# EAGLE design ESP_Hub (EAGLE 9.6.0)
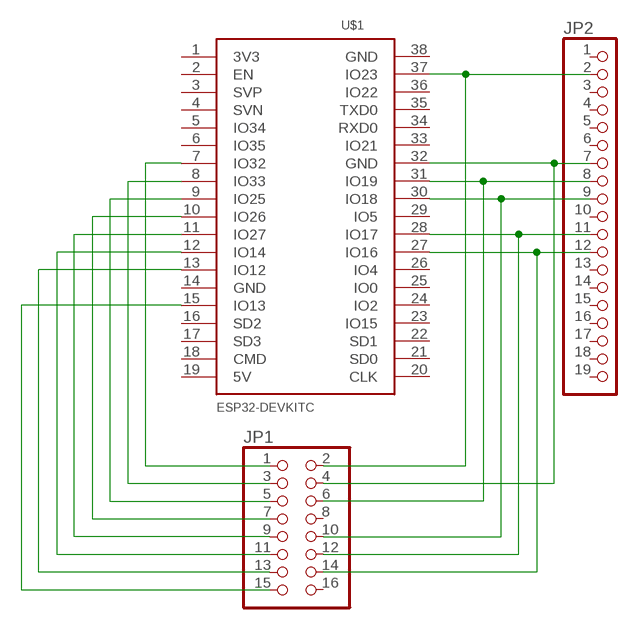
[diagram p0: schematic, sheet 1]

## Parts
JP1  PINHD-2X8  [2X08]
JP2  PINHD-1X19  [1X19]
U$1  ESP32DEVKITC  [ESP32-DEVKITC]

## Nets
N$1: JP1.1 U$1.7(IO32)
N$2: JP1.3 U$1.8(IO33)
N$3: JP1.5 U$1.9(IO25)
N$4: JP1.15 U$1.15(IO13)
N$5: JP1.7 U$1.10(IO26)
N$6: JP1.9 U$1.11(IO27)
N$7: JP1.11 U$1.12(IO14)
N$8: JP1.13 U$1.13(IO12)
N$9: JP1.2 JP2.2 U$1.37(IO23)
N$10: JP1.6 JP2.8 U$1.31(IO19)
N$11: JP1.10 JP2.9 U$1.30(IO18)
N$12: JP1.12 JP2.11 U$1.28(IO17)
N$13: JP1.14 JP2.12 U$1.27(IO16)
N$14: JP1.4 JP2.7 U$1.32(GND)
Unconnected: JP1.8 JP1.16 JP2.1 JP2.3 JP2.4 JP2.5 JP2.6 JP2.10 JP2.13 JP2.14 JP2.15 JP2.16 JP2.17 JP2.18 JP2.19 U$1.1(3V3) U$1.2(EN) U$1.3(SVP) U$1.4(SVN) U$1.5(IO34) U$1.6(IO35) U$1.14(GND) U$1.16(SD2) U$1.17(SD3) U$1.18(CMD) U$1.19(5V) U$1.20(CLK) U$1.21(SD0) U$1.22(SD1) U$1.23(IO15) U$1.24(IO2) U$1.25(IO0) U$1.26(IO4) U$1.29(IO5) U$1.33(IO21) U$1.34(RXD0) U$1.35(TXD0) U$1.36(IO22) U$1.38(GND)

## Library data of the parts
JP1 = pinhead:PINHD-2X8: PIN HEADER
JP2 = pinhead:PINHD-1X19: PIN HEADER
U$1 = ESP32-DEVKITC:ESP32DEVKITC

## Board
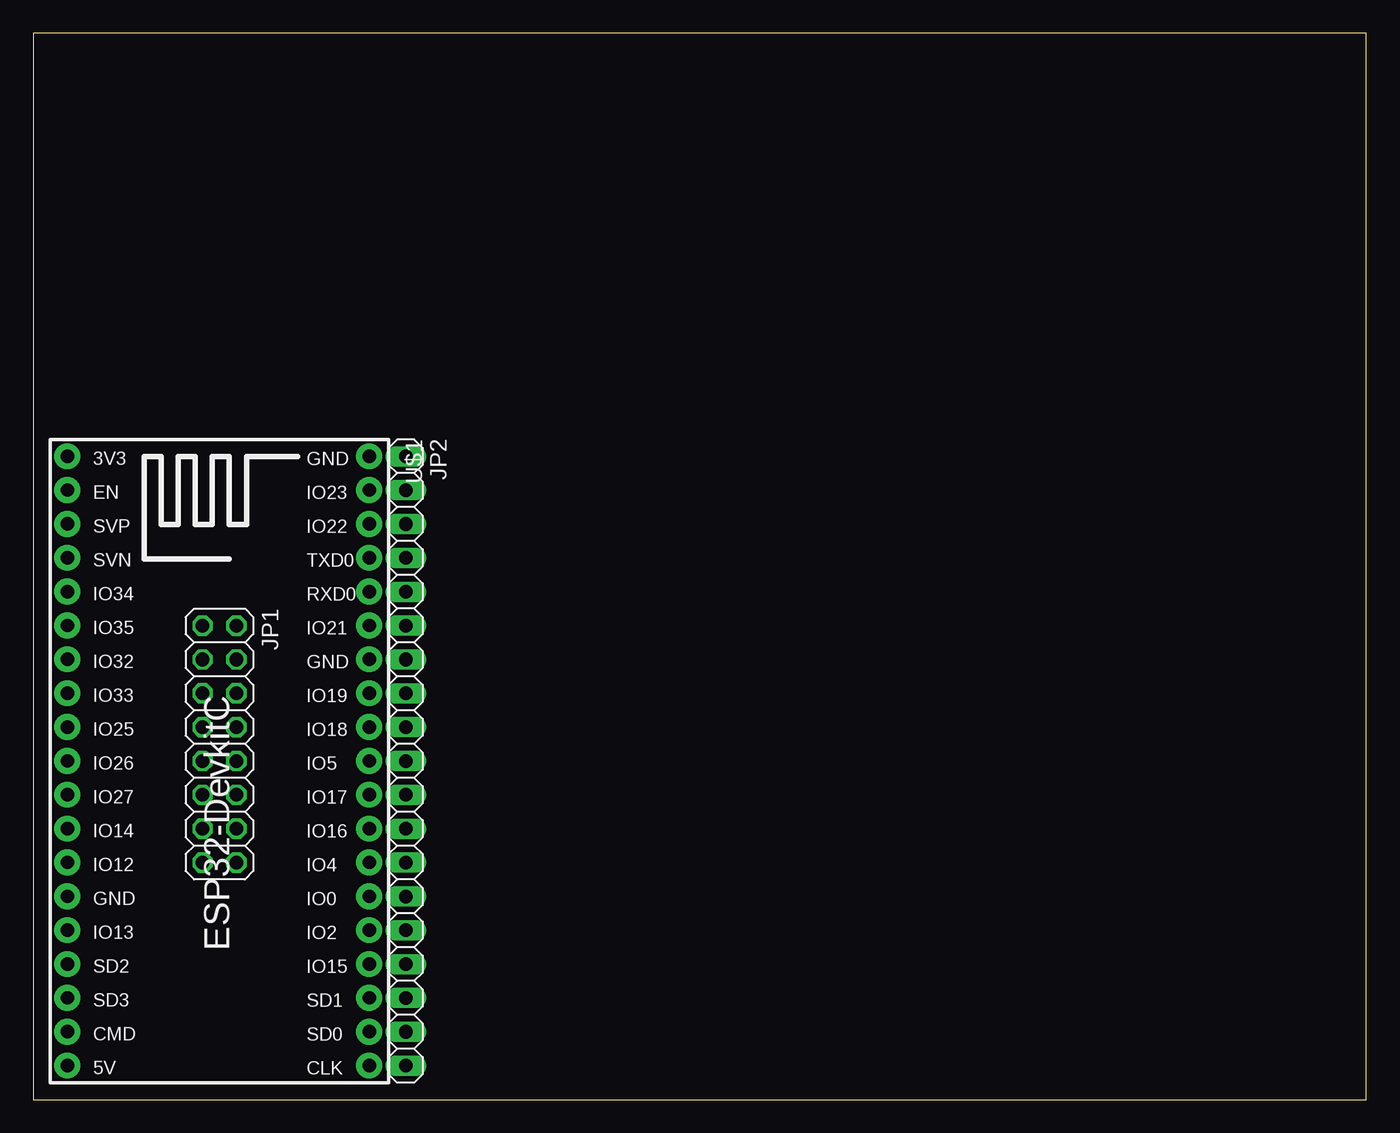
[diagram p1: board, top side]
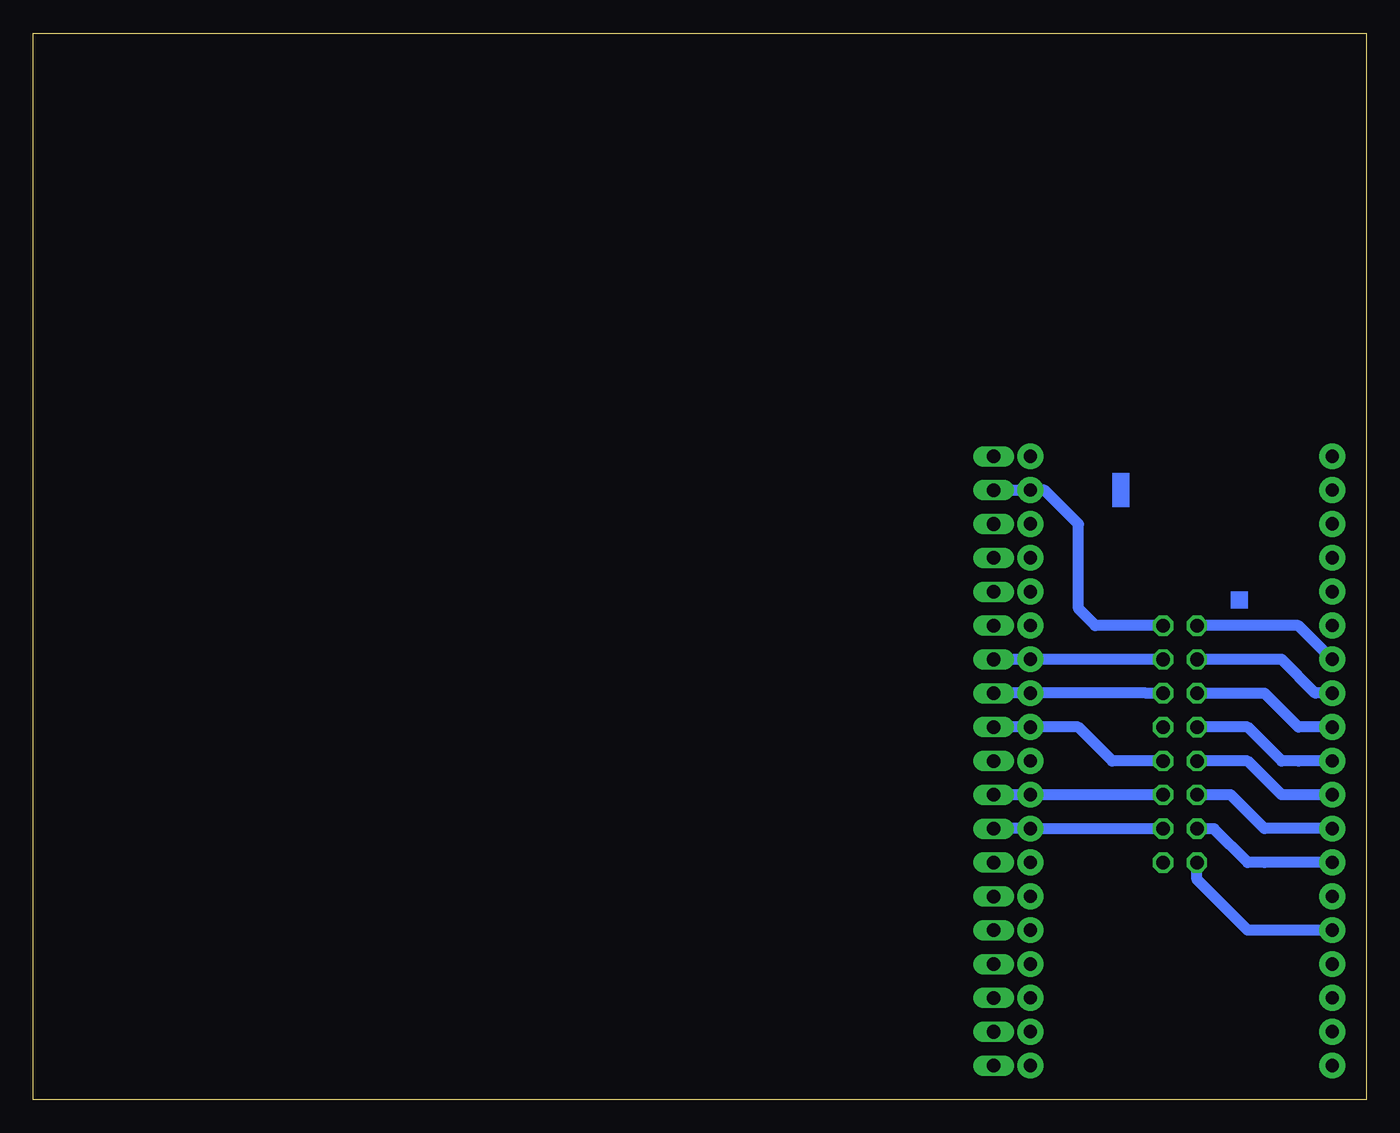
[diagram p2: board, bottom side, seen from below]

Size 100 x 80 mm. Coordinates in mm from the lower left corner, seen from the top.
Outline: 0,0 100,0 100,80 0,80 0,0
Copper layers (1*16): Top 0.035mm / dielectric 1.5mm / Bottom 0.035mm
Design rules "default": minimum track width 6mil, minimum drill 0.35mm, track to track 6mil, track to pad 6mil, pad to pad 6mil, via to via 6mil, smd to smd 6mil, copper to edge 40mil, drill to drill 6mil, minimum pad ring 10mil, minimum via ring 8mil, stop-mask expansion 4mil, vias tented up to drill 0mil, thermal gap 10mil

### Footprints (pad centres in the part's own frame; a part is rotated, then mirrored left to right if it is on the bottom)
2X08 = drill 1.016 octagon: 1 -8.89,-1.27; 2 -8.89,1.27; 3 -6.35,-1.27; 4 -6.35,1.27; 5 -3.81,-1.27; 6 -3.81,1.27; 7 -1.27,-1.27; 8 -1.27,1.27; 9 1.27,-1.27; 10 1.27,1.27; 11 3.81,-1.27; 12 3.81,1.27; 13 6.35,-1.27; 14 6.35,1.27; 15 8.89,-1.27; 16 8.89,1.27
1X19 = drill 1.016 long: 1 -22.86,0; 2 -20.32,0; 3 -17.78,0; 4 -15.24,0; 5 -12.7,0; 6 -10.16,0; 7 -7.62,0; 8 -5.08,0; 9 -2.54,0; 10 0,0; 11 2.54,0; 12 5.08,0; 13 7.62,0; 14 10.16,0; 15 12.7,0; 16 15.24,0; 17 17.78,0; 18 20.32,0; 19 22.86,0
ESP32-DEVKITC = drill 1 pad 1.93: 1 -22.87,-11.42; 2 -20.33,-11.42; 3 -17.79,-11.42; 4 -15.25,-11.42; 5 -12.71,-11.42; 6 -10.17,-11.42; 7 -7.63,-11.42; 8 -5.09,-11.42; 9 -2.55,-11.42; 10 -0.01,-11.42; 11 2.53,-11.42; 12 5.07,-11.42; 13 7.61,-11.42; 14 10.15,-11.42; 15 12.69,-11.42; 16 15.23,-11.42; 17 17.77,-11.42; 18 20.31,-11.42; 19 22.85,-11.42; 20 22.85,11.23; 21 20.31,11.23; 22 17.77,11.23; 23 15.23,11.23; 24 12.69,11.23; 25 10.15,11.23; 26 7.61,11.23; 27 5.07,11.23; 28 2.53,11.23; 29 -0.01,11.23; 30 -2.55,11.23; 31 -5.09,11.23; 32 -7.63,11.23; 33 -10.17,11.23; 34 -12.71,11.23; 35 -15.25,11.23; 36 -17.79,11.23; 37 -20.33,11.23; 38 -22.87,11.23

### Placement (x,y rotation side)
JP1  13.97,26.67 270 top
JP2  27.94,25.4 270 top
U$1  13.97,25.4 270 top

### Tracks (layer width: path | path; a pad name or v marks a point on that pad's centre or on a via)
N$1
  Bottom 0.813: U$1.7 5.08,35.56 JP1.1
N$2
  Bottom 0.813: U$1.8 3.8,30.49 3.81,30.48 6.35,33.02 JP1.3
N$3
  Bottom 0.813: U$1.9 5.07,27.95 5.08,27.94 7.62,30.48 JP1.5
N$4
  Bottom 0.813: U$1.15 8.9,12.71 12.7,16.51 JP1.15
N$5
  Bottom 0.813: U$1.10 5.07,25.41 5.08,25.4 6.35,25.4 8.89,27.94 JP1.7
N$6
  Bottom 0.813: U$1.11 6.34,22.87 6.35,22.86 8.89,25.4 JP1.9
N$7
  Bottom 0.813: U$1.12 7.61,20.33 7.62,20.32 10.16,22.86 JP1.11
N$8
  Bottom 0.813: U$1.13 7.61,17.79 7.62,17.78 8.89,17.78 11.43,20.32 JP1.13
N$9
  Bottom 0.813: U$1.37 24.99,45.52 | JP1.2 20.32,35.56 21.59,36.83 21.59,43.18 24.14,45.73 U$1.37 | U$1.37 JP2.2
N$10
  Bottom 0.813: JP1.6 16.51,30.48 16.52,30.49 U$1.31 JP2.8
N$11
  Bottom 0.813: JP1.10 19.05,25.4 21.6,27.95 U$1.30 JP2.9
N$12
  Bottom 0.813: JP1.12 22.86,22.86 | 22.87,22.87 22.86,22.86 | 22.86,22.86 U$1.28 JP2.11
N$13
  Bottom 0.813: JP1.14 21.59,20.32 | 21.59,20.32 21.6,20.33 | 21.59,20.32 U$1.27 JP2.12
N$14
  Bottom 0.813: JP1.4 U$1.32 JP2.7
(copper drawn outside any net)
  shapes: Bottom area x3